# EAGLE schematic scheamt_projekt (EAGLE 6.3)
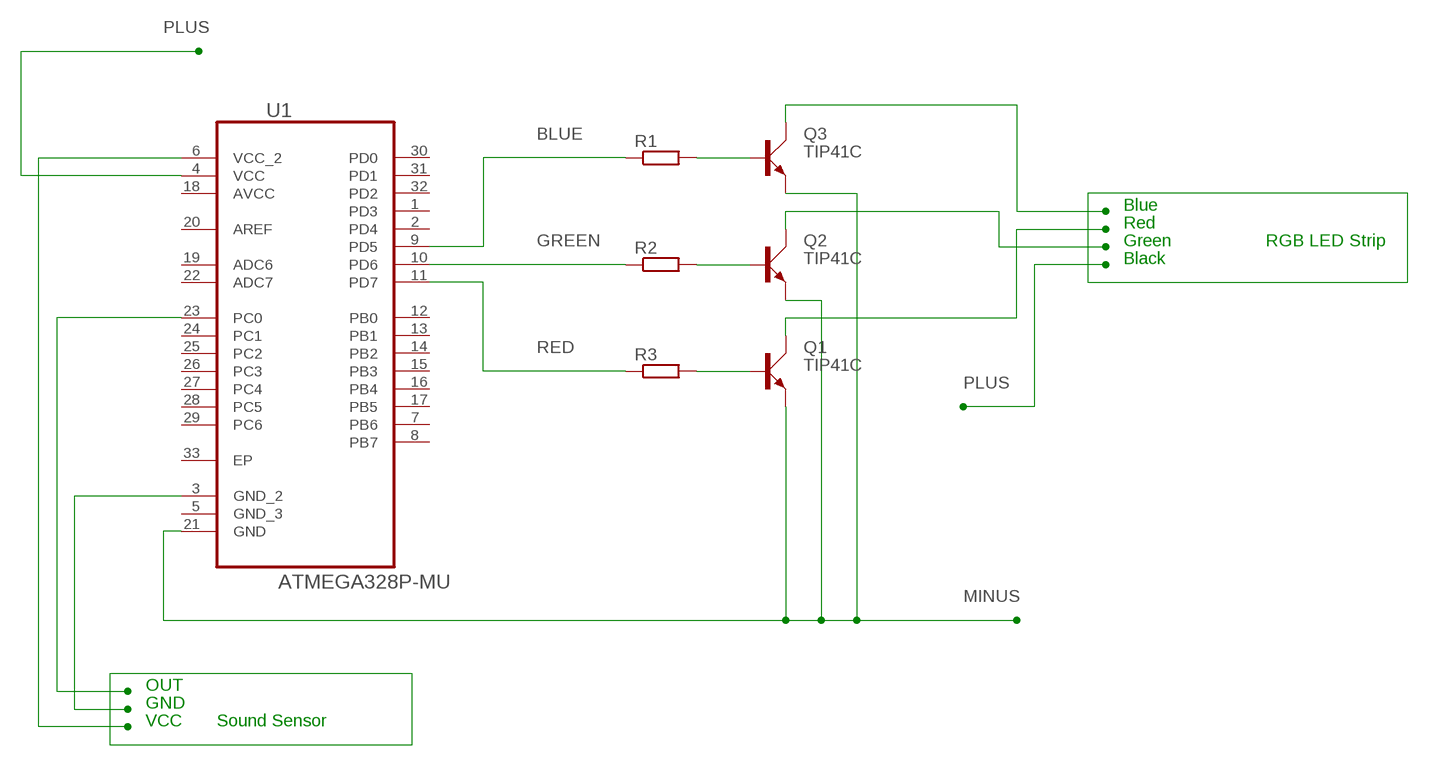
[diagram p0: schematic, sheet 1]

## Parts
Q1  TIP41C  [TO220AV]
Q2  TIP41C  [TO220AV]
Q3  TIP41C  [TO220AV]
R1  R-EU_0204/7  [0204/7]
R2  R-EU_0204/7  [0204/7]
R3  R-EU_0204/7  [0204/7]
U1  ATMEGA328P-MU  [QFN50P500X500X100-33N]

## Nets
BLUE: R1.1 U1.9(PD5)
GREEN: R2.1 U1.10(PD6)
MINUS: Q1.E Q2.E Q3.E U1.21(GND)
N$2: Q1.B R3.2
N$3: Q2.B R2.2
N$4: Q3.B R1.2
N$5: Q3.C
N$6: Q2.C
N$7: Q1.C
N$8: U1.3(GND_2)
N$9: U1.6(VCC_2)
N$10: U1.23(PC0)
PLUS: U1.4(VCC)
RED: R3.1 U1.11(PD7)
Unconnected: U1.1(PD3) U1.2(PD4) U1.5(GND_3) U1.7(PB6) U1.8(PB7) U1.12(PB0) U1.13(PB1) U1.14(PB2) U1.15(PB3) U1.16(PB4) U1.17(PB5) U1.19(ADC6) U1.20(AREF) U1.22(ADC7) U1.24(PC1) U1.25(PC2) U1.26(PC3) U1.27(PC4) U1.28(PC5) U1.29(PC6) U1.30(PD0) U1.31(PD1) U1.32(PD2) U1.33(EP)

## Notes on the sheet
- Blue
- Red
- Green | RGB LED Strip
- Black
- OUT
- GND
- VCC | Sound Sensor

## Power pins joined to a net without a drawn wire
AVCC: U1.18(AVCC)

## Library data of the parts
Q1-Q3 = transistor-power:TIP41C: NPN TRANSISTOR
R1-R3 = rcl:R-EU_: RESISTOR, European symbol
U1 = Atmel_By_element14_Batch_1-00:ATMEGA328P-MU: Programmable Flash; MPN: ATMEGA328P-MU; OC_FARNELL: 1748522; OC_NEWARK: 26R2526; PACKAGE: QFN-32; SUPPLIER: Atmel